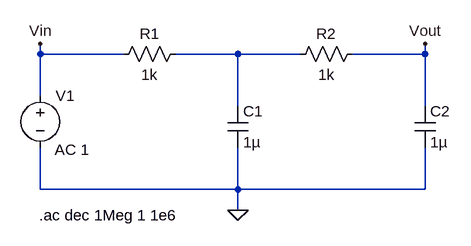
[diagram p0: schematic second_order_rc.asc]
second_order_rc.asc, the LTspice schematic file:
Version 4
SHEET 1 880 680
WIRE -16 80 -16 64
WIRE 112 80 -16 80
WIRE 288 80 192 80
WIRE 384 80 288 80
WIRE 576 80 576 64
WIRE 576 80 464 80
WIRE -16 144 -16 80
WIRE 288 160 288 80
WIRE 576 160 576 80
WIRE -16 288 -16 224
WIRE 288 288 288 224
WIRE 288 288 -16 288
WIRE 576 288 576 224
WIRE 576 288 288 288
WIRE 288 320 288 288
FLAG 288 320 0
FLAG -16 64 Vin
FLAG 576 64 Vout
SYMBOL res 208 64 R90
WINDOW 0 0 56 VBottom 2
WINDOW 3 32 56 VTop 2
SYMATTR InstName R1
SYMATTR Value 1k
SYMBOL cap 272 160 R0
SYMATTR InstName C1
SYMATTR Value 1µ
SYMBOL cap 560 160 R0
SYMATTR InstName C2
SYMATTR Value 1µ
SYMBOL res 480 64 R90
WINDOW 0 0 56 VBottom 2
WINDOW 3 32 56 VTop 2
SYMATTR InstName R2
SYMATTR Value 1k
SYMBOL voltage -16 128 R0
WINDOW 123 22 99 Left 2
WINDOW 39 0 0 Left 0
SYMATTR InstName V1
SYMATTR Value ""
SYMATTR Value2 AC 1
TEXT -18 328 Left 2 !.ac dec 1Meg 1 1e6

The netlist it stands for:
* second_order_rc.asc
R1 N001 Vin 1k
C1 N001 0 1µ
C2 Vout 0 1µ
R2 Vout N001 1k
V1 Vin 0 AC 1
.ac dec 1Meg 1 1e6
.backanno
.end